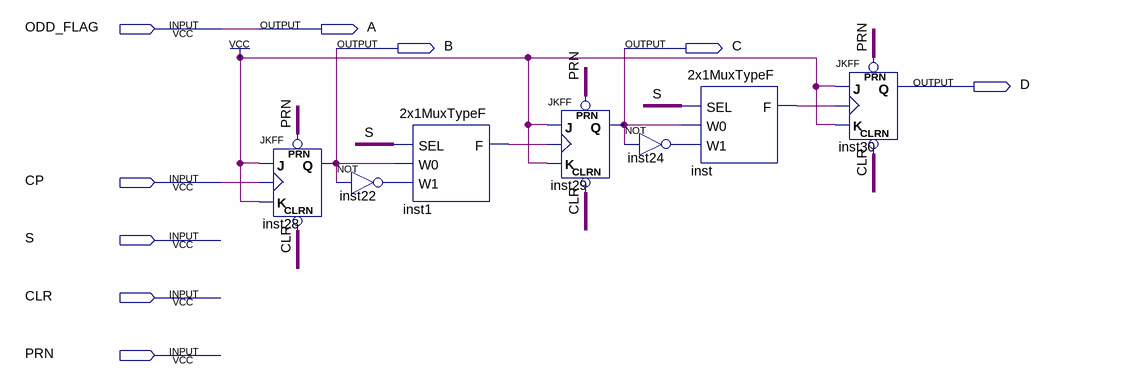
[diagram p0: schematic sheet]
// Quartus schematic Problem3.bdf as structural Verilog: 7 symbols, 9 pins
module Problem3 (
  input  ODD_FLAG,
  input  CP,
  input  S,
  input  CLR,
  input  PRN,
  output A,
  output B,
  output C,
  output D
);

  wire inst1_f, inst22_out, inst24_out, inst_f;

  JKFF inst28 (.PRN(PRN), .CLRN(CLR), .K(1'b1), .J(1'b1), .CLK(CP), .Q(B));
  not inst22 (inst22_out, B);
  \2x1MuxTypeF  inst1 (.SEL(S), .W0(B), .W1(inst22_out), .F(inst1_f));
  JKFF inst29 (.PRN(PRN), .CLRN(CLR), .K(1'b1), .J(1'b1), .CLK(inst1_f), .Q(C));
  \2x1MuxTypeF  inst (.SEL(S), .W0(C), .W1(inst24_out), .F(inst_f));
  not inst24 (inst24_out, C);
  JKFF inst30 (.PRN(PRN), .CLRN(CLR), .K(1'b1), .J(1'b1), .CLK(inst_f), .Q(D));

  assign A = ODD_FLAG;
endmodule
